# EAGLE schematic HDMIspartan6_Rev_A.brd (EAGLE 7.7.0)

## Sheet 1 of 4
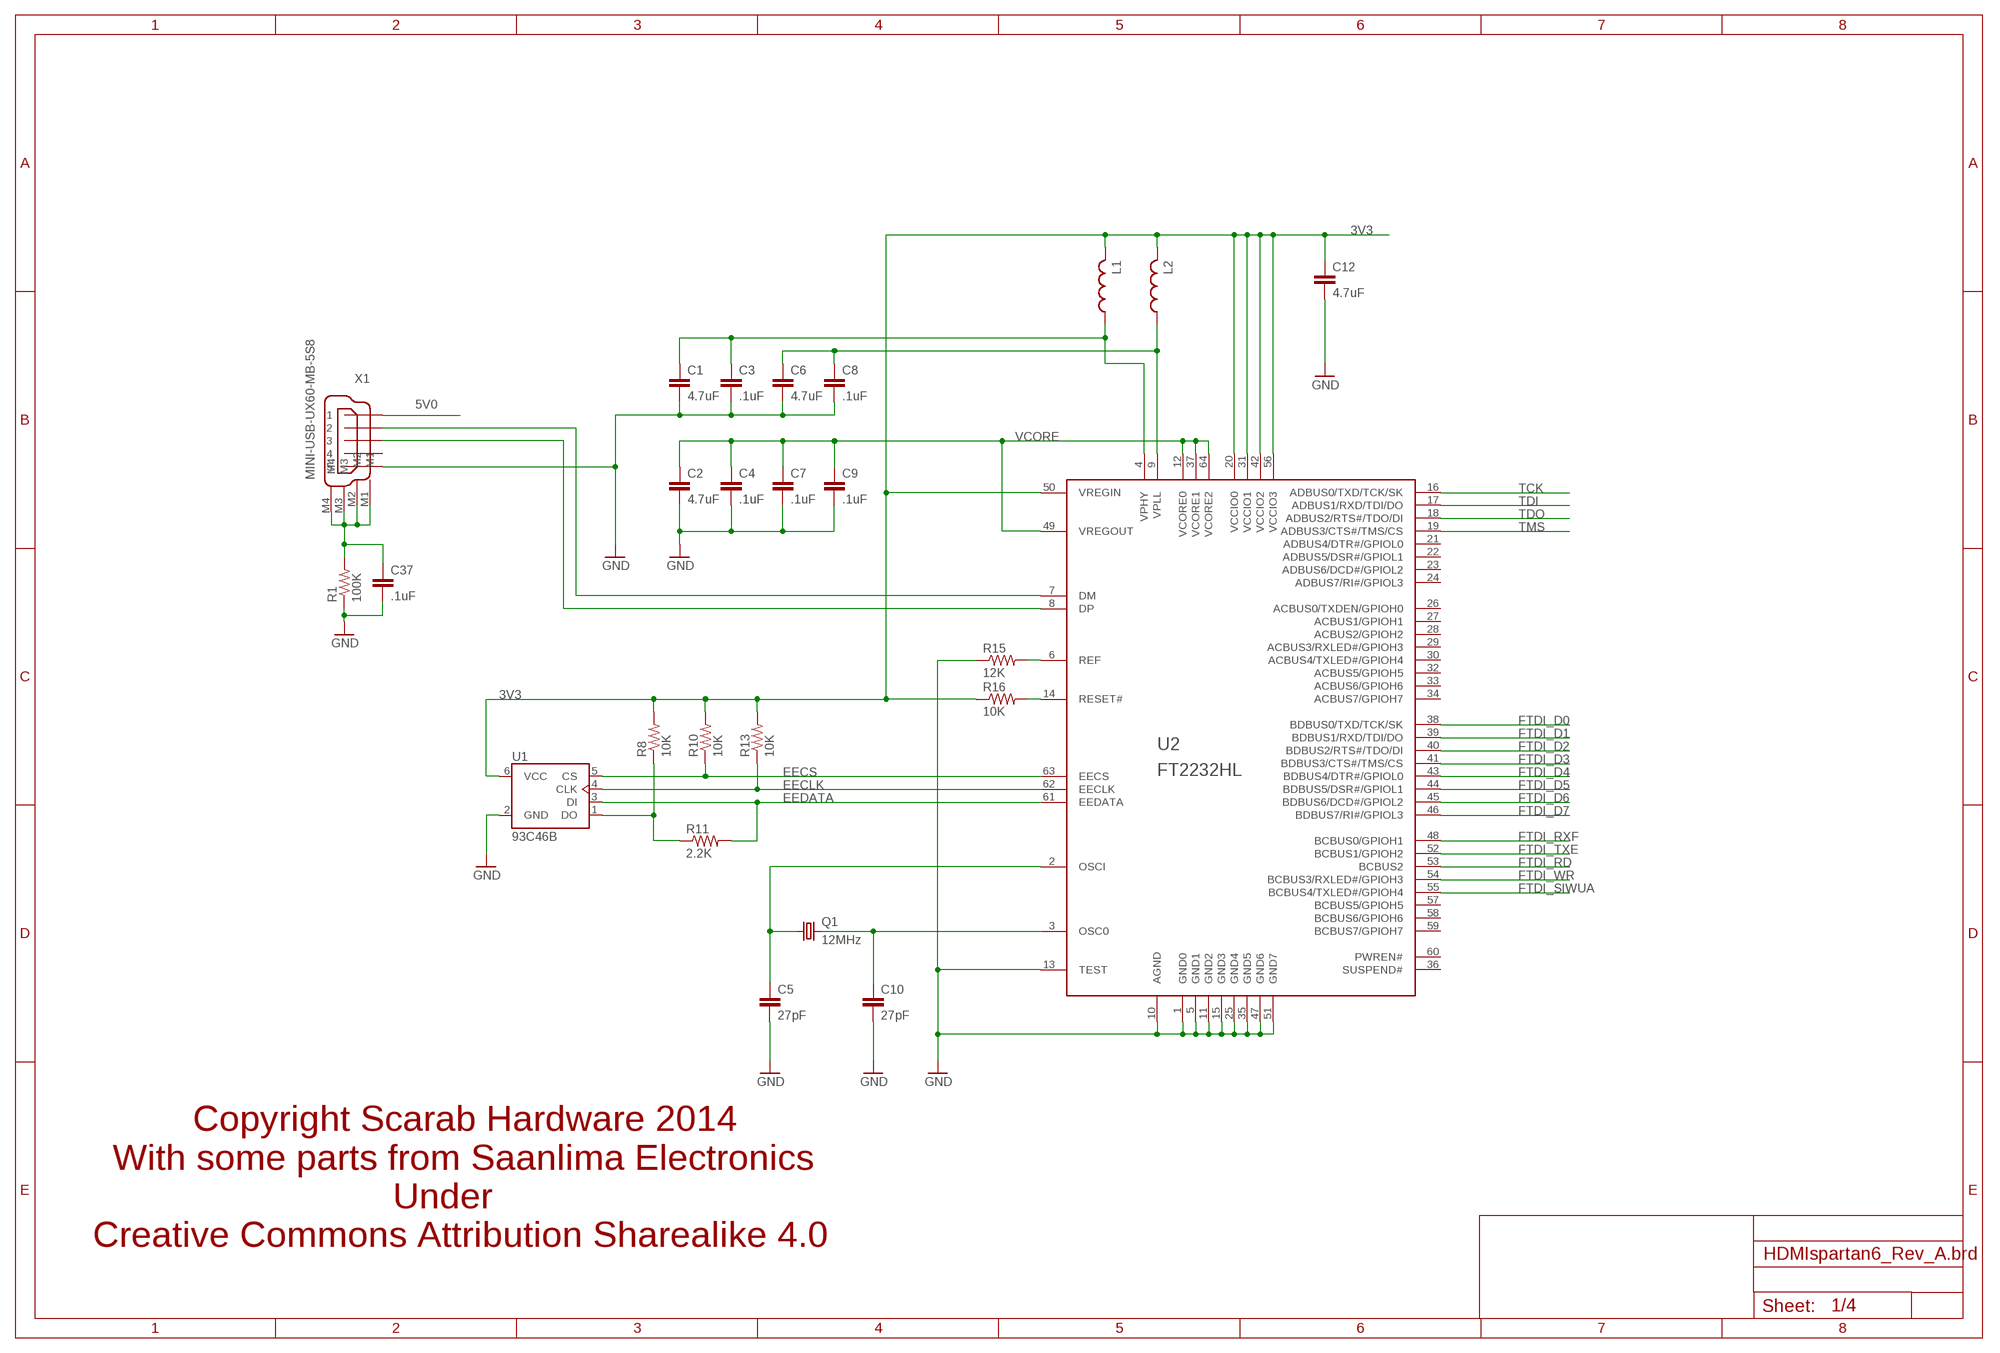
[diagram p0: schematic, sheet 1]

### Parts
C1  4.7uF  C-EUC0603K  [C0603K]
C2  4.7uF  C-EUC0603K  [C0603K]
C3  .1uF  C-EUC0603K  [C0603K]
C4  .1uF  C-EUC0603K  [C0603K]
C5  27pF  C-EUC0603K  [C0603K]
C6  4.7uF  C-EUC0603K  [C0603K]
C7  .1uF  C-EUC0603K  [C0603K]
C8  .1uF  C-EUC0603K  [C0603K]
C9  .1uF  C-EUC0603K  [C0603K]
C10  27pF  C-EUC0603K  [C0603K]
C12  4.7uF  C-EUC0603K  [C0603K]
C37  .1uF  C-EUC0603K  [C0603K]
L1  L-USL2012C  [L2012C]
L2  L-USL2012C  [L2012C]
Q1  12MHz  CRYSTAL3.2X2.5  [CRYSTAL3.2X2.5MM]
R1  100K  R-US_R0603  [R0603]
R8  10K  R-US_R0603  [R0603]
R10  10K  R-US_R0603  [R0603]
R11  2.2K  R-US_R0603  [R0603]
R13  10K  R-US_R0603  [R0603]
R15  12K  R-US_R0603  [R0603]
R16  10K  R-US_R0603  [R0603]
U1  93C46B  DIGITAL-EEPROM-MICROWIRE-6P_SOT23  [SOT23-6]
U2  FT2232HL  FT2232H  [LQFP64]
X1  MINI-USB-UX60-MB-5S8  [UX60-MB-5S8]

### Nets
3V3: C12.1 L1.2 L2.2 R8.2 R10.2 R13.2 R16.1 U1.6(VCC) U2.20(VCCIO0) U2.31(VCCIO1) U2.42(VCCIO2) U2.50(VREGIN) U2.56(VCCIO3) ; also sheet 2,3,4
5V0: X1.1 ; also sheet 3
EECLK: R13.1 U1.4(CLK) U2.62(EECLK)
EECS: R10.1 U1.5(CS) U2.63(EECS)
EEDATA: R11.2 U1.3(DI) U2.61(EEDATA)
FTDI_D0: U2.38(BDBUS0/TXD/TCK/SK) ; also sheet 2
FTDI_D1: U2.39(BDBUS1/RXD/TDI/DO) ; also sheet 2
FTDI_D2: U2.40(BDBUS2/RTS#/TDO/DI) ; also sheet 2
FTDI_D3: U2.41(BDBUS3/CTS#/TMS/CS) ; also sheet 2
FTDI_D4: U2.43(BDBUS4/DTR#/GPIOL0) ; also sheet 2
FTDI_D5: U2.44(BDBUS5/DSR#/GPIOL1) ; also sheet 2
FTDI_D6: U2.45(BDBUS6/DCD#/GPIOL2) ; also sheet 2
FTDI_D7: U2.46(BDBUS7/RI#/GPIOL3) ; also sheet 2
FTDI_RD: U2.53(BCBUS2) ; also sheet 2
FTDI_RXF: U2.48(BCBUS0/GPIOH1) ; also sheet 2
FTDI_SIWUA: U2.55(BCBUS4/TXLED#/GPIOH4) ; also sheet 2
FTDI_TXE: U2.52(BCBUS1/GPIOH2) ; also sheet 2
FTDI_WR: U2.54(BCBUS3/RXLED#/GPIOH3) ; also sheet 2
GND: C1.2 C2.2 C3.2 C4.2 C5.2 C6.2 C7.2 C8.2 C9.2 C10.2 C12.2 C37.2 R1.1 R15.1 U1.2(GND) U2.1(GND0) U2.5(GND1) U2.10(AGND) U2.11(GND2) U2.13(TEST) U2.15(GND3) U2.25(GND4) U2.35(GND5) U2.47(GND6) U2.51(GND7) X1.5 ; also sheet 2,3,4
N$10: U2.7(DM) X1.2
N$13: C37.1 R1.2 X1.M1 X1.M2 X1.M3 X1.M4
N$14: U2.8(DP) X1.3
N$15: C5.1 Q1.1 U2.2(OSCI)
N$16: C10.1 Q1.3 U2.3(OSC0)
N$18: C6.1 C8.1 L2.1 U2.9(VPLL)
N$19: R16.2 U2.14(RESET#)
N$20: R15.2 U2.6(REF)
N$21: C1.1 C3.1 L1.1 U2.4(VPHY)
N$27: R8.1 R11.1 U1.1(DO)
TCK: U2.16(ADBUS0/TXD/TCK/SK) ; also sheet 2
TDI: U2.17(ADBUS1/RXD/TDI/DO) ; also sheet 2
TDO: U2.18(ADBUS2/RTS#/TDO/DI) ; also sheet 2
TMS: U2.19(ADBUS3/CTS#/TMS/CS) ; also sheet 2
VCORE: C2.1 C4.1 C7.1 C9.1 U2.12(VCORE0) U2.37(VCORE1) U2.49(VREGOUT) U2.64(VCORE2)
Unconnected: U2.21(ADBUS4/DTR#/GPIOL0) U2.22(ADBUS5/DSR#/GPIOL1) U2.23(ADBUS6/DCD#/GPIOL2) U2.24(ADBUS7/RI#/GPIOL3) U2.26(ACBUS0/TXDEN/GPIOH0) U2.27(ACBUS1/GPIOH1) U2.28(ACBUS2/GPIOH2) U2.29(ACBUS3/RXLED#/GPIOH3) U2.30(ACBUS4/TXLED#/GPIOH4) U2.32(ACBUS5/GPIOH5) U2.33(ACBUS6/GPIOH6) U2.34(ACBUS7/GPIOH7) U2.36(SUSPEND#) U2.57(BCBUS5/GPIOH5) U2.58(BCBUS6/GPIOH6) U2.59(BCBUS7/GPIOH7) U2.60(PWREN#) X1.4

### Notes on the sheet
- Copyright Scarab Hardware 2014
    With some parts from Saanlima Electronics
                                Under
  Creative Commons Attribution Sharealike 4.0

## Sheet 2 of 4
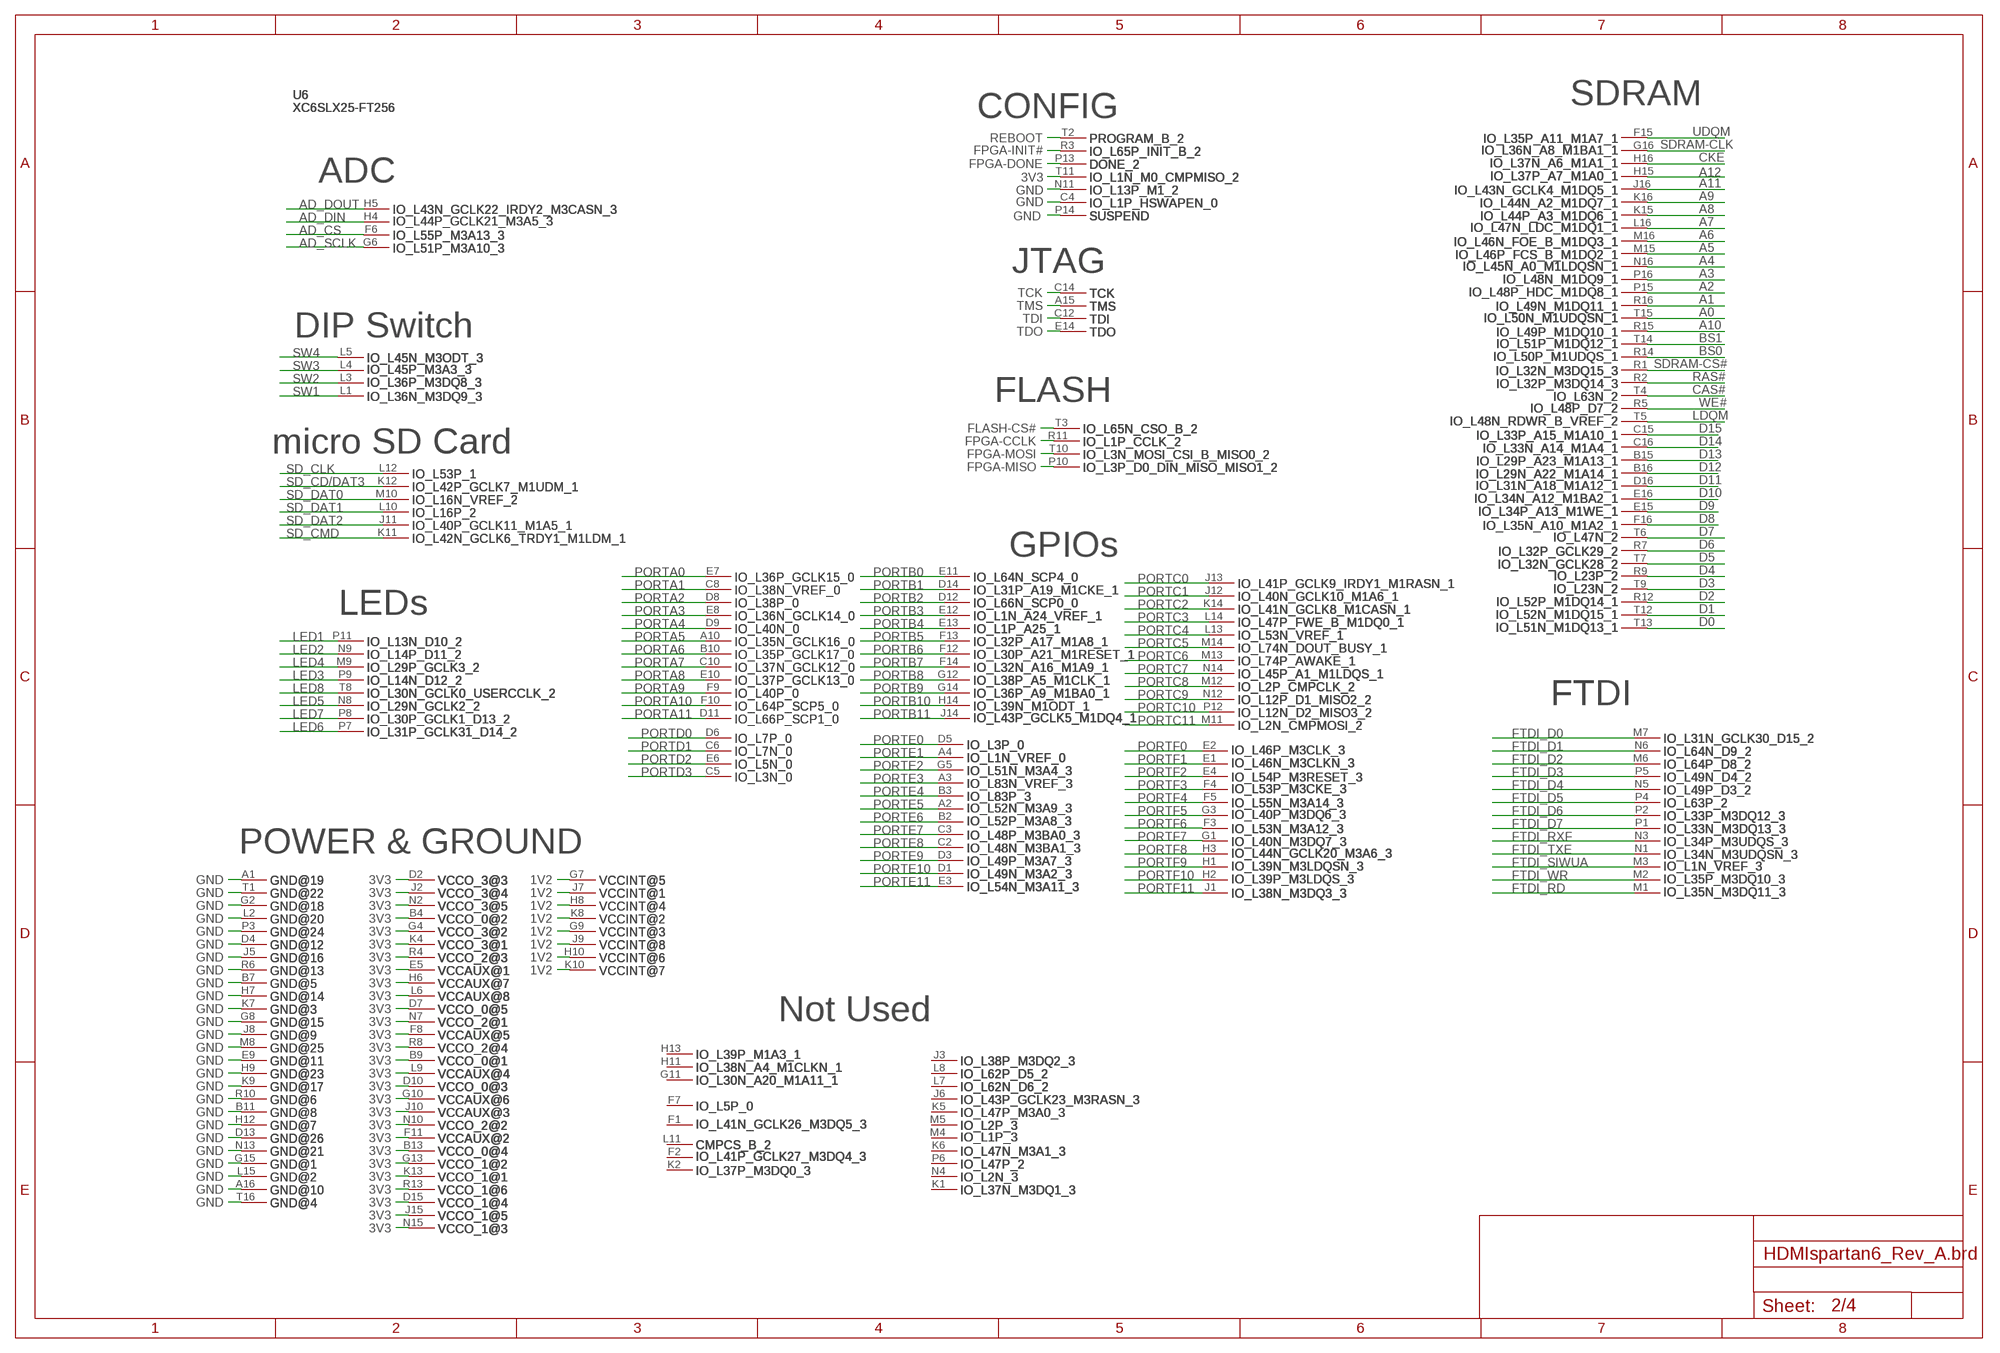
[diagram p1: schematic, sheet 2]

### Parts
U6  XC6SLX25-FT256  [XILINX-FT256]

### Nets
1V2: U6.G7 U6.G9 U6.H8 U6.H10 U6.J7 U6.J9 U6.K8 U6.K10 ; also sheet 3
3V3: U6.B4 U6.B9 U6.B13 U6.D2 U6.D7 U6.D10 U6.D15 U6.E5 U6.F8 U6.F11 U6.G4 U6.G10 U6.G13 U6.H6 U6.J2 U6.J10 U6.J15 U6.K4 U6.K13 U6.L6 U6.L9 U6.N2 U6.N7 U6.N10 U6.N15 U6.R4 U6.R8 U6.R13 U6.T11 ; also sheet 1,3,4
A0: U6.T15 ; also sheet 3
A1: U6.R16 ; also sheet 3
A2: U6.P15 ; also sheet 3
A3: U6.P16 ; also sheet 3
A4: U6.N16 ; also sheet 3
A5: U6.M15 ; also sheet 3
A6: U6.M16 ; also sheet 3
A7: U6.L16 ; also sheet 3
A8: U6.K15 ; also sheet 3
A9: U6.K16 ; also sheet 3
A10: U6.R15 ; also sheet 3
A11: U6.J16 ; also sheet 3
A12: U6.H15 ; also sheet 3
AD_CS: U6.F6 ; also sheet 3
AD_DIN: U6.H4 ; also sheet 3
AD_DOUT: U6.H5 ; also sheet 3
AD_SCLK: U6.G6 ; also sheet 3
BS0: U6.R14 ; also sheet 3
BS1: U6.T14 ; also sheet 3
CAS#: U6.T4 ; also sheet 3
CKE: U6.H16 ; also sheet 3
D0: U6.T13 ; also sheet 3
D1: U6.T12 ; also sheet 3
D2: U6.R12 ; also sheet 3
D3: U6.T9 ; also sheet 3
D4: U6.R9 ; also sheet 3
D5: U6.T7 ; also sheet 3
D6: U6.R7 ; also sheet 3
D7: U6.T6 ; also sheet 3
D8: U6.F16 ; also sheet 3
D9: U6.E15 ; also sheet 3
D10: U6.E16 ; also sheet 3
D11: U6.D16 ; also sheet 3
D12: U6.B16 ; also sheet 3
D13: U6.B15 ; also sheet 3
D14: U6.C16 ; also sheet 3
D15: U6.C15 ; also sheet 3
FLASH-CS#: U6.T3 ; also sheet 3
FPGA-CCLK: U6.R11 ; also sheet 3
FPGA-DONE: U6.P13
FPGA-INIT#: U6.R3
FPGA-MISO: U6.P10 ; also sheet 3
FPGA-MOSI: U6.T10 ; also sheet 3
FTDI_D0: U6.M7 ; also sheet 1
FTDI_D1: U6.N6 ; also sheet 1
FTDI_D2: U6.M6 ; also sheet 1
FTDI_D3: U6.P5 ; also sheet 1
FTDI_D4: U6.N5 ; also sheet 1
FTDI_D5: U6.P4 ; also sheet 1
FTDI_D6: U6.P2 ; also sheet 1
FTDI_D7: U6.P1 ; also sheet 1
FTDI_RD: U6.M1 ; also sheet 1
FTDI_RXF: U6.N3 ; also sheet 1
FTDI_SIWUA: U6.M3 ; also sheet 1
FTDI_TXE: U6.N1 ; also sheet 1
FTDI_WR: U6.M2 ; also sheet 1
GND: U6.A1 U6.A16 U6.B7 U6.B11 U6.C4 U6.D4 U6.D13 U6.E9 U6.G2 U6.G8 U6.G15 U6.H7 U6.H9 U6.H12 U6.J5 U6.J8 U6.K7 U6.K9 U6.L2 U6.L15 U6.M8 U6.N11 U6.N13 U6.P3 U6.P14 U6.R6 U6.R10 U6.T1 U6.T16 ; also sheet 1,3,4
LDQM: U6.T5 ; also sheet 3
LED1: U6.P11 ; also sheet 3
LED2: U6.N9 ; also sheet 3
LED3: U6.P9 ; also sheet 3
LED4: U6.M9 ; also sheet 3
LED5: U6.N8 ; also sheet 3
LED6: U6.P7 ; also sheet 3
LED7: U6.P8 ; also sheet 3
LED8: U6.T8 ; also sheet 3
PORTA0: U6.E7 ; also sheet 3
PORTA1: U6.C8 ; also sheet 3
PORTA2: U6.D8 ; also sheet 3
PORTA3: U6.E8 ; also sheet 3
PORTA4: U6.D9 ; also sheet 3
PORTA5: U6.A10 ; also sheet 3
PORTA6: U6.B10 ; also sheet 3
PORTA7: U6.C10 ; also sheet 3
PORTA8: U6.E10 ; also sheet 3
PORTA9: U6.F9 ; also sheet 3
PORTA10: U6.F10 ; also sheet 3
PORTA11: U6.D11 ; also sheet 3
PORTB0: U6.E11 ; also sheet 3
PORTB1: U6.D14 ; also sheet 3
PORTB2: U6.D12 ; also sheet 3
PORTB3: U6.E12 ; also sheet 3
PORTB4: U6.E13 ; also sheet 3
PORTB5: U6.F13 ; also sheet 3
PORTB6: U6.F12 ; also sheet 3
PORTB7: U6.F14 ; also sheet 3
PORTB8: U6.G12 ; also sheet 3
PORTB9: U6.G14 ; also sheet 3
PORTB10: U6.H14 ; also sheet 3
PORTB11: U6.J14 ; also sheet 3
PORTC0: U6.J13 ; also sheet 3
PORTC1: U6.J12 ; also sheet 3
PORTC2: U6.K14 ; also sheet 3
PORTC3: U6.L14 ; also sheet 3
PORTC4: U6.L13 ; also sheet 3
PORTC5: U6.M14 ; also sheet 3
PORTC6: U6.M13 ; also sheet 3
PORTC7: U6.N14 ; also sheet 3
PORTC8: U6.M12 ; also sheet 3
PORTC9: U6.N12 ; also sheet 3
PORTC10: U6.P12 ; also sheet 3
PORTC11: U6.M11 ; also sheet 3
PORTD0: U6.D6 ; also sheet 3
PORTD1: U6.C6 ; also sheet 3
PORTD2: U6.E6 ; also sheet 3
PORTD3: U6.C5 ; also sheet 3
PORTE0: U6.D5 ; also sheet 3
PORTE1: U6.A4 ; also sheet 3
PORTE2: U6.G5 ; also sheet 3
PORTE3: U6.A3 ; also sheet 3
PORTE4: U6.B3 ; also sheet 3
PORTE5: U6.A2 ; also sheet 3
PORTE6: U6.B2 ; also sheet 3
PORTE7: U6.C3 ; also sheet 3
PORTE8: U6.C2 ; also sheet 3
PORTE9: U6.D3 ; also sheet 3
PORTE10: U6.D1 ; also sheet 3
PORTE11: U6.E3 ; also sheet 3
PORTF0: U6.E2 ; also sheet 3
PORTF1: U6.E1 ; also sheet 3
PORTF2: U6.E4 ; also sheet 3
PORTF3: U6.F4 ; also sheet 3
PORTF4: U6.F5 ; also sheet 3
PORTF5: U6.G3 ; also sheet 3
PORTF6: U6.F3 ; also sheet 3
PORTF7: U6.G1 ; also sheet 3
PORTF8: U6.H3 ; also sheet 3
PORTF9: U6.H1 ; also sheet 3
PORTF10: U6.H2 ; also sheet 3
PORTF11: U6.J1 ; also sheet 3
RAS#: U6.R2 ; also sheet 3
REBOOT: U6.T2 ; also sheet 3
SD_CD/DAT3: U6.K12 ; also sheet 3
SD_CLK: U6.L12 ; also sheet 3
SD_CMD: U6.K11 ; also sheet 3
SD_DAT0: U6.M10 ; also sheet 3
SD_DAT1: U6.L10 ; also sheet 3
SD_DAT2: U6.J11 ; also sheet 3
SDRAM-CLK: U6.G16 ; also sheet 3
SDRAM-CS#: U6.R1 ; also sheet 3
SW1: U6.L1 ; also sheet 3
SW2: U6.L3 ; also sheet 3
SW3: U6.L4 ; also sheet 3
SW4: U6.L5 ; also sheet 3
TCK: U6.C14 ; also sheet 1
TDI: U6.C12 ; also sheet 1
TDO: U6.E14 ; also sheet 1
TMS: U6.A15 ; also sheet 1
UDQM: U6.F15 ; also sheet 3
WE#: U6.R5 ; also sheet 3
Unconnected: U6.F1 U6.F2 U6.F7 U6.G11 U6.H11 U6.H13 U6.J3 U6.J6 U6.K1 U6.K2 U6.K5 U6.K6 U6.L7 U6.L8 U6.L11 U6.M4 U6.M5 U6.N4 U6.P6

### Notes on the sheet
- CONFIG
- SDRAM
- ADC
- JTAG
- DIP Switch
- FLASH
- micro SD Card
- GPIOs
- LEDs
- FTDI
- POWER & GROUND
- Not Used

## Sheet 3 of 4
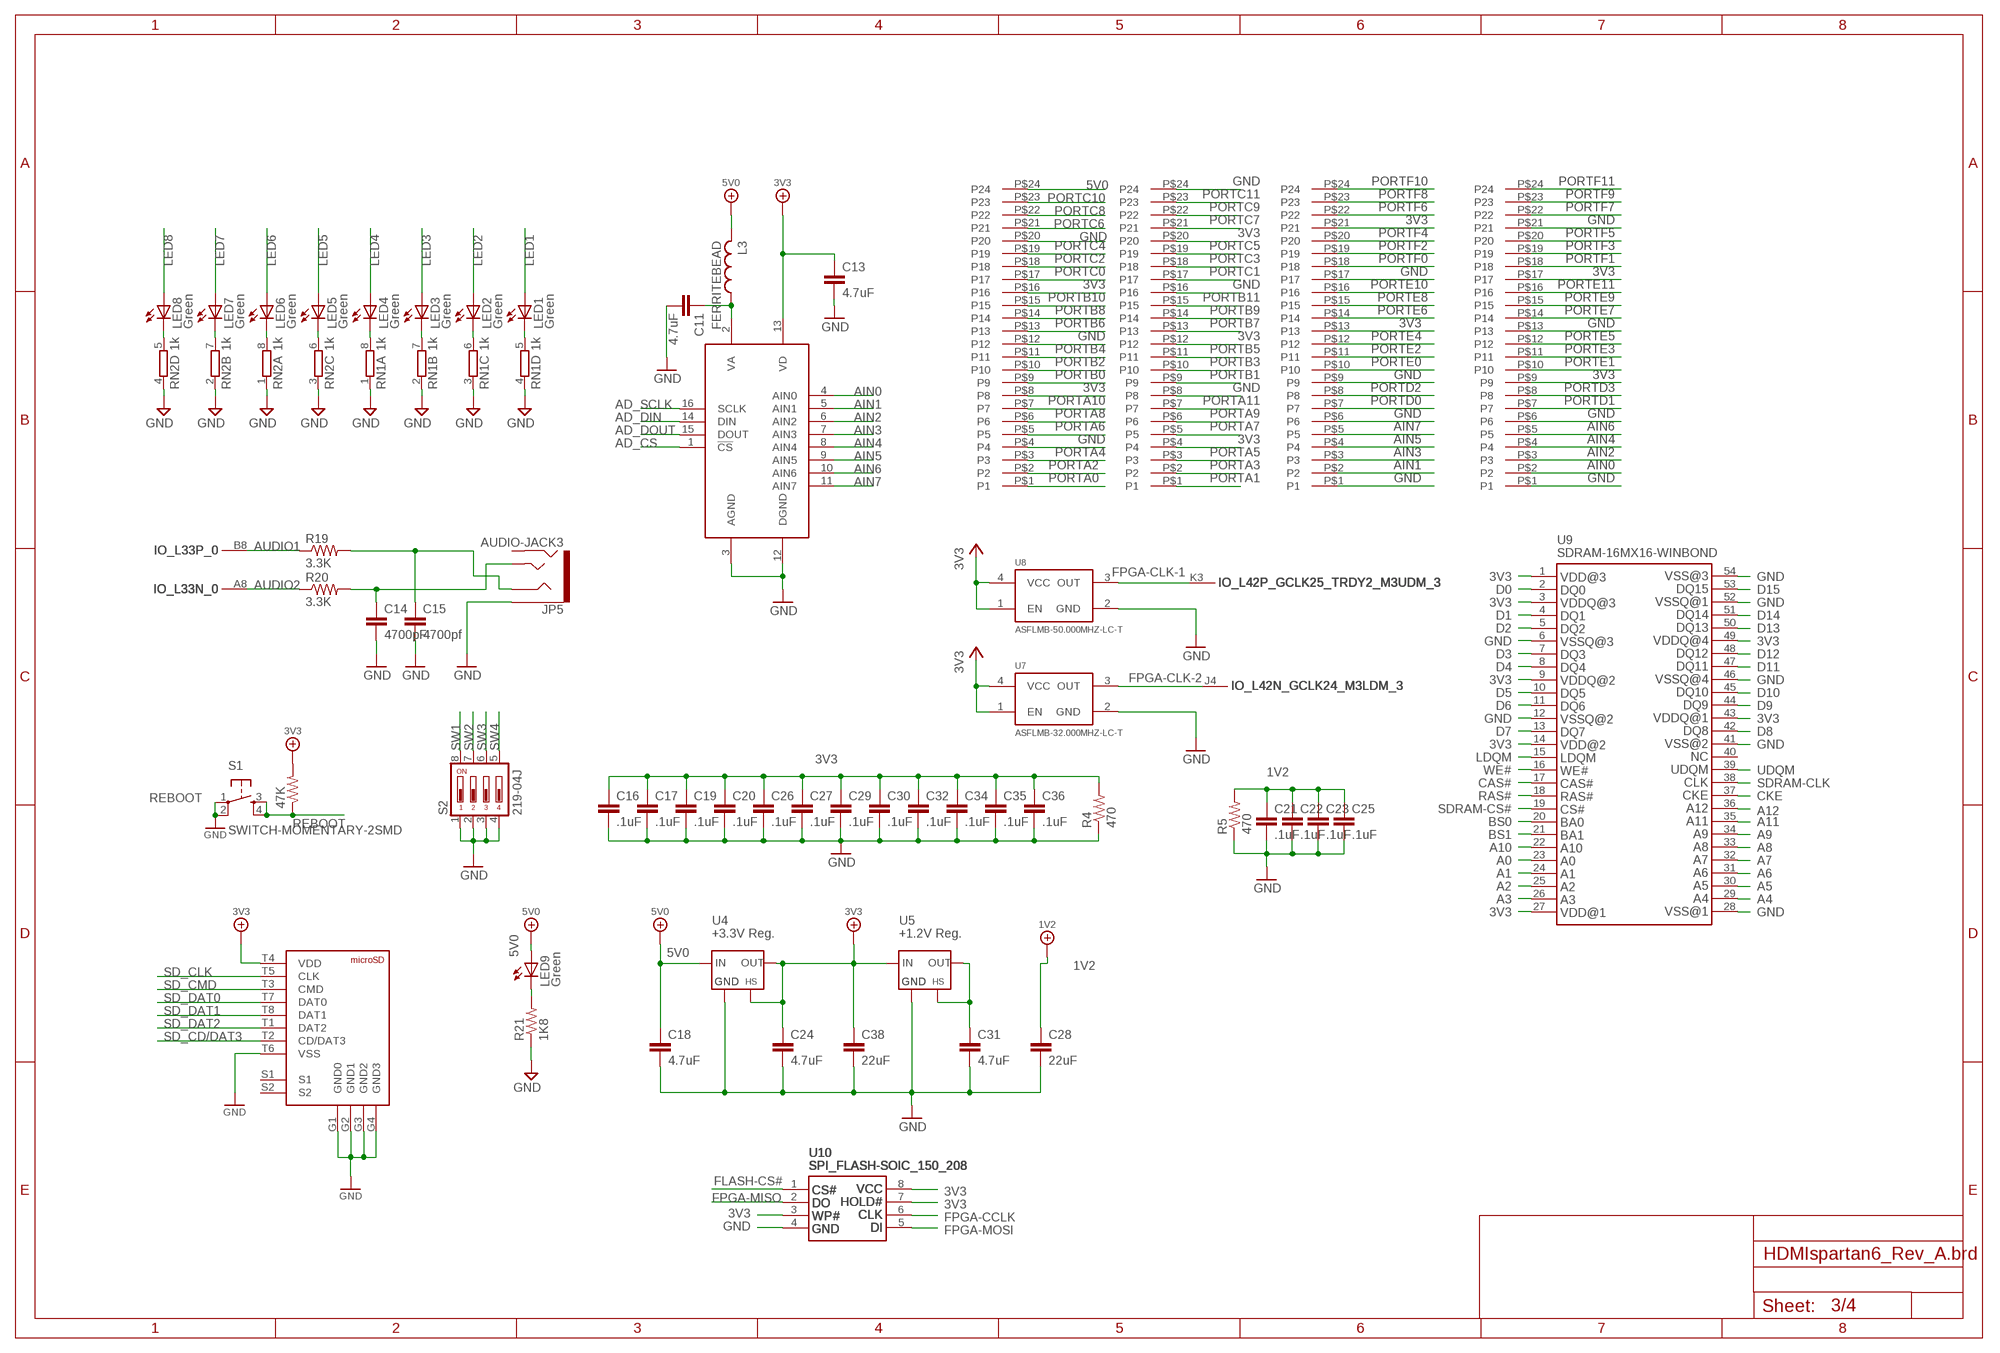
[diagram p2: schematic, sheet 3]

### Parts
C11  4.7uF  C-EUC0603K  [C0603K]
C13  4.7uF  C-EUC0603K  [C0603K]
C14  4700pF  C-EUC0603K  [C0603K]
C15  4700pf  C-EUC0603K  [C0603K]
C16  .1uF  C-EUC0603K  [C0603K]
C17  .1uF  C-EUC0603K  [C0603K]
C18  4.7uF  C-EUC0603K  [C0603K]
C19  .1uF  C-EUC0603K  [C0603K]
C20  .1uF  C-EUC0603K  [C0603K]
C21  .1uF  C-EUC0603K  [C0603K]
C22  .1uF  C-EUC0603K  [C0603K]
C23  .1uF  C-EUC0603K  [C0603K]
C24  4.7uF  C-EUC0603K  [C0603K]
C25  .1uF  C-EUC0603K  [C0603K]
C26  .1uF  C-EUC0603K  [C0603K]
C27  .1uF  C-EUC0603K  [C0603K]
C28  22uF  C-EUC0603K  [C0603K]
C29  .1uF  C-EUC0603K  [C0603K]
C30  .1uF  C-EUC0603K  [C0603K]
C31  4.7uF  C-EUC0603K  [C0603K]
C32  .1uF  C-EUC0603K  [C0603K]
C34  .1uF  C-EUC0603K  [C0603K]
C35  .1uF  C-EUC0603K  [C0603K]
C36  .1uF  C-EUC0603K  [C0603K]
C38  22uF  C-EUC0603K  [C0603K]
J4  P24-1  [1X24]
J5  MICROSD_MOLEX  [MICROSD_104031]
J6  P24-1  [1X24]
JP5  AUDIO-JACK3  [AUDIO-JACK-TRRS-SMD]
L3  FERRITEBEAD  L-USL2012C  [L2012C]
LED1  Green  LEDSML0603  [SML0603]
LED2  Green  LEDSML0603  [SML0603]
LED3  Green  LEDSML0603  [SML0603]
LED4  Green  LEDSML0603  [SML0603]
LED5  Green  LEDSML0603  [SML0603]
LED6  Green  LEDSML0603  [SML0603]
LED7  Green  LEDSML0603  [SML0603]
LED8  Green  LEDSML0603  [SML0603]
LED9  Green  LEDSML0603  [SML0603]
R4  470  R-US_R0603  [R0603]
R5  470  R-US_R0603  [R0603]
R18  47K  R-US_R0603  [R0603]
R19  3.3K  R-US_R0603  [R0603]
R20  3.3K  R-US_R0603  [R0603]
R21  1K8  R-US_R0603  [R0603]
RN1  1k  4R-N0603-ARV  [0603-ARV]
RN2  1k  4R-N0603-ARV  [0603-ARV]
S1  SWITCH-MOMENTARY-2SMD  TAC_SWITCHSMD  [TACTILE_SWITCH_SMD]
S2  219-04J  [CTS-219-04J]
U3  ADC088S102CIMT  [TSSOP16]
U4  +3.3V Reg.  FAN1117  [SOT223]
U5  +1.2V Reg.  FAN1112  [SOT223]
U7  ASFLMB-32.000MHZ-LC-T  OSCILLATOR5X3-PIN1-INDICATED  [CRYSTAL-OSC-SMD-5X3]
U8  ASFLMB-50.000MHZ-LC-T  OSCILLATOR5X3-PIN1-INDICATED  [CRYSTAL-OSC-SMD-5X3]
U9  SDRAM-16MX16-WINBOND  [TSOPII-54]
U10  SPI_FLASH-SOIC_150_208  [SPI-8_SOIC_150_208]
U$7  P24-1  [1X24]
U$8  P24-1  [1X24]

### Nets
1V2: C21.1 C22.1 C23.1 C25.1 C28.1 R5.2 ; also sheet 2
3V3: C13.1 C16.1 C17.1 C19.1 C20.1 C24.1 C26.1 C27.1 C29.1 C30.1 C32.1 C34.1 C35.1 C36.1 C38.1 J4.P$13(P13) J4.P$21(P21) J5.T4(VDD) J6.P$9(P9) J6.P$17(P17) R4.2 R18.2 U3.13(VD) U4.2(OUT) U4.4(HS) U5.3(IN) U7.1(EN) U7.4(VCC) U8.1(EN) U8.4(VCC) U9.1 U9.3 U9.9 U9.14 U9.27 U9.43 U9.49 U10.3 U10.7 U10.8 U$7.P$8(P8) U$7.P$16(P16) U$8.P$4(P4) U$8.P$12(P12) U$8.P$20(P20) ; also sheet 1,2,4
5V0: C18.1 L3.2 LED9.A U4.3(IN) U$7.P$24(P24) ; also sheet 1
A0: U9.23 ; also sheet 2
A1: U9.24 ; also sheet 2
A2: U9.25 ; also sheet 2
A3: U9.26 ; also sheet 2
A4: U9.29 ; also sheet 2
A5: U9.30 ; also sheet 2
A6: U9.31 ; also sheet 2
A7: U9.32 ; also sheet 2
A8: U9.33 ; also sheet 2
A9: U9.34 ; also sheet 2
A10: U9.22 ; also sheet 2
A11: U9.35 ; also sheet 2
A12: U9.36 ; also sheet 2
AD_CS: U3.1(!CS) ; also sheet 2
AD_DIN: U3.14(DIN) ; also sheet 2
AD_DOUT: U3.15(DOUT) ; also sheet 2
AD_SCLK: U3.16(SCLK) ; also sheet 2
AIN0: J6.P$2(P2) U3.4(AIN0)
AIN1: J4.P$2(P2) U3.5(AIN1)
AIN2: J6.P$3(P3) U3.6(AIN2)
AIN3: J4.P$3(P3) U3.7(AIN3)
AIN4: J6.P$4(P4) U3.8(AIN4)
AIN5: J4.P$4(P4) U3.9(AIN5)
AIN6: J6.P$5(P5) U3.10(AIN6)
AIN7: J4.P$5(P5) U3.11(AIN7)
AUDIO1: R19.1 U6.B8
AUDIO2: R20.1 U6.A8
BS0: U9.20 ; also sheet 2
BS1: U9.21 ; also sheet 2
CAS#: U9.17 ; also sheet 2
CKE: U9.37 ; also sheet 2
D0: U9.2 ; also sheet 2
D1: U9.4 ; also sheet 2
D2: U9.5 ; also sheet 2
D3: U9.7 ; also sheet 2
D4: U9.8 ; also sheet 2
D5: U9.10 ; also sheet 2
D6: U9.11 ; also sheet 2
D7: U9.13 ; also sheet 2
D8: U9.42 ; also sheet 2
D9: U9.44 ; also sheet 2
D10: U9.45 ; also sheet 2
D11: U9.47 ; also sheet 2
D12: U9.48 ; also sheet 2
D13: U9.50 ; also sheet 2
D14: U9.51 ; also sheet 2
D15: U9.53 ; also sheet 2
FLASH-CS#: U10.1 ; also sheet 2
FPGA-CCLK: U10.6 ; also sheet 2
FPGA-CLK-1: U6.K3 U8.3(OUT)
FPGA-CLK-2: U6.J4 U7.3(OUT)
FPGA-MISO: U10.2 ; also sheet 2
FPGA-MOSI: U10.5 ; also sheet 2
GND: C11.2 C13.2 C14.2 C15.2 C16.2 C17.2 C18.2 C19.2 C20.2 C21.2 C22.2 C23.2 C24.2 C25.2 C26.2 C27.2 C28.2 C29.2 C30.2 C31.2 C32.2 C34.2 C35.2 C36.2 C38.2 J4.P$1(P1) J4.P$6(P6) J4.P$9(P9) J4.P$17(P17) J5.G1(GND0) J5.G2(GND1) J5.G3(GND2) J5.G4(GND3) J5.T6(VSS) J6.P$1(P1) J6.P$6(P6) J6.P$13(P13) J6.P$21(P21) JP5.EARTH R4.1 R5.1 R21.1 RN1.1 RN1.2 RN1.3 RN1.4 RN2.1 RN2.2 RN2.3 RN2.4 S1.1 S1.2 S2.1 S2.2 S2.3 S2.4 U3.3(AGND) U3.12(DGND) U4.1(GND) U5.1(GND) U7.2(GND) U8.2(GND) U9.6 U9.12 U9.28 U9.41 U9.46 U9.52 U9.54 U10.4 U$7.P$4(P4) U$7.P$12(P12) U$7.P$20(P20) U$8.P$8(P8) U$8.P$16(P16) U$8.P$24(P24) ; also sheet 1,2,4
LDQM: U9.15 ; also sheet 2
LED1: LED1.A ; also sheet 2
LED2: LED2.A ; also sheet 2
LED3: LED3.A ; also sheet 2
LED4: LED4.A ; also sheet 2
LED5: LED5.A ; also sheet 2
LED6: LED6.A ; also sheet 2
LED7: LED7.A ; also sheet 2
LED8: LED8.A ; also sheet 2
N$1: LED9.C R21.2
N$2: C11.1 L3.1 U3.2(VA)
N$3: LED1.C RN1.5
N$4: LED2.C RN1.6
N$5: LED3.C RN1.7
N$6: LED4.C RN1.8
N$7: LED5.C RN2.6
N$9: LED6.C RN2.8
N$11: LED7.C RN2.7
N$12: LED8.C RN2.5
N$17: C31.1 U5.2(OUT) U5.4(HS)
N$24: C14.1 JP5.TIP R20.2
N$25: C15.1 JP5.RING1 R19.2
PORTA0: U$7.P$1(P1) ; also sheet 2
PORTA1: U$8.P$1(P1) ; also sheet 2
PORTA2: U$7.P$2(P2) ; also sheet 2
PORTA3: U$8.P$2(P2) ; also sheet 2
PORTA4: U$7.P$3(P3) ; also sheet 2
PORTA5: U$8.P$3(P3) ; also sheet 2
PORTA6: U$7.P$5(P5) ; also sheet 2
PORTA7: U$8.P$5(P5) ; also sheet 2
PORTA8: U$7.P$6(P6) ; also sheet 2
PORTA9: U$8.P$6(P6) ; also sheet 2
PORTA10: U$7.P$7(P7) ; also sheet 2
PORTA11: U$8.P$7(P7) ; also sheet 2
PORTB0: U$7.P$9(P9) ; also sheet 2
PORTB1: U$8.P$9(P9) ; also sheet 2
PORTB2: U$7.P$10(P10) ; also sheet 2
PORTB3: U$8.P$10(P10) ; also sheet 2
PORTB4: U$7.P$11(P11) ; also sheet 2
PORTB5: U$8.P$11(P11) ; also sheet 2
PORTB6: U$7.P$13(P13) ; also sheet 2
PORTB7: U$8.P$13(P13) ; also sheet 2
PORTB8: U$7.P$14(P14) ; also sheet 2
PORTB9: U$8.P$14(P14) ; also sheet 2
PORTB10: U$7.P$15(P15) ; also sheet 2
PORTB11: U$8.P$15(P15) ; also sheet 2
PORTC0: U$7.P$17(P17) ; also sheet 2
PORTC1: U$8.P$17(P17) ; also sheet 2
PORTC2: U$7.P$18(P18) ; also sheet 2
PORTC3: U$8.P$18(P18) ; also sheet 2
PORTC4: U$7.P$19(P19) ; also sheet 2
PORTC5: U$8.P$19(P19) ; also sheet 2
PORTC6: U$7.P$21(P21) ; also sheet 2
PORTC7: U$8.P$21(P21) ; also sheet 2
PORTC8: U$7.P$22(P22) ; also sheet 2
PORTC9: U$8.P$22(P22) ; also sheet 2
PORTC10: U$7.P$23(P23) ; also sheet 2
PORTC11: U$8.P$23(P23) ; also sheet 2
PORTD0: J4.P$7(P7) ; also sheet 2
PORTD1: J6.P$7(P7) ; also sheet 2
PORTD2: J4.P$8(P8) ; also sheet 2
PORTD3: J6.P$8(P8) ; also sheet 2
PORTE0: J4.P$10(P10) ; also sheet 2
PORTE1: J6.P$10(P10) ; also sheet 2
PORTE2: J4.P$11(P11) ; also sheet 2
PORTE3: J6.P$11(P11) ; also sheet 2
PORTE4: J4.P$12(P12) ; also sheet 2
PORTE5: J6.P$12(P12) ; also sheet 2
PORTE6: J4.P$14(P14) ; also sheet 2
PORTE7: J6.P$14(P14) ; also sheet 2
PORTE8: J4.P$15(P15) ; also sheet 2
PORTE9: J6.P$15(P15) ; also sheet 2
PORTE10: J4.P$16(P16) ; also sheet 2
PORTE11: J6.P$16(P16) ; also sheet 2
PORTF0: J4.P$18(P18) ; also sheet 2
PORTF1: J6.P$18(P18) ; also sheet 2
PORTF2: J4.P$19(P19) ; also sheet 2
PORTF3: J6.P$19(P19) ; also sheet 2
PORTF4: J4.P$20(P20) ; also sheet 2
PORTF5: J6.P$20(P20) ; also sheet 2
PORTF6: J4.P$22(P22) ; also sheet 2
PORTF7: J6.P$22(P22) ; also sheet 2
PORTF8: J4.P$23(P23) ; also sheet 2
PORTF9: J6.P$23(P23) ; also sheet 2
PORTF10: J4.P$24(P24) ; also sheet 2
PORTF11: J6.P$24(P24) ; also sheet 2
RAS#: U9.18 ; also sheet 2
REBOOT: R18.1 S1.3 S1.4 ; also sheet 2
SD_CD/DAT3: J5.T2(CD/DAT3) ; also sheet 2
SD_CLK: J5.T5(CLK) ; also sheet 2
SD_CMD: J5.T3(CMD) ; also sheet 2
SD_DAT0: J5.T7(DAT0) ; also sheet 2
SD_DAT1: J5.T8(DAT1) ; also sheet 2
SD_DAT2: J5.T1(DAT2) ; also sheet 2
SDRAM-CLK: U9.38 ; also sheet 2
SDRAM-CS#: U9.19 ; also sheet 2
SW1: S2.8 ; also sheet 2
SW2: S2.7 ; also sheet 2
SW3: S2.6 ; also sheet 2
SW4: S2.5 ; also sheet 2
UDQM: U9.39 ; also sheet 2
WE#: U9.16 ; also sheet 2
Unconnected: J5.S1 J5.S2 JP5.RING2 U9.40

### Notes on the sheet
- REBOOT

## Sheet 4 of 4
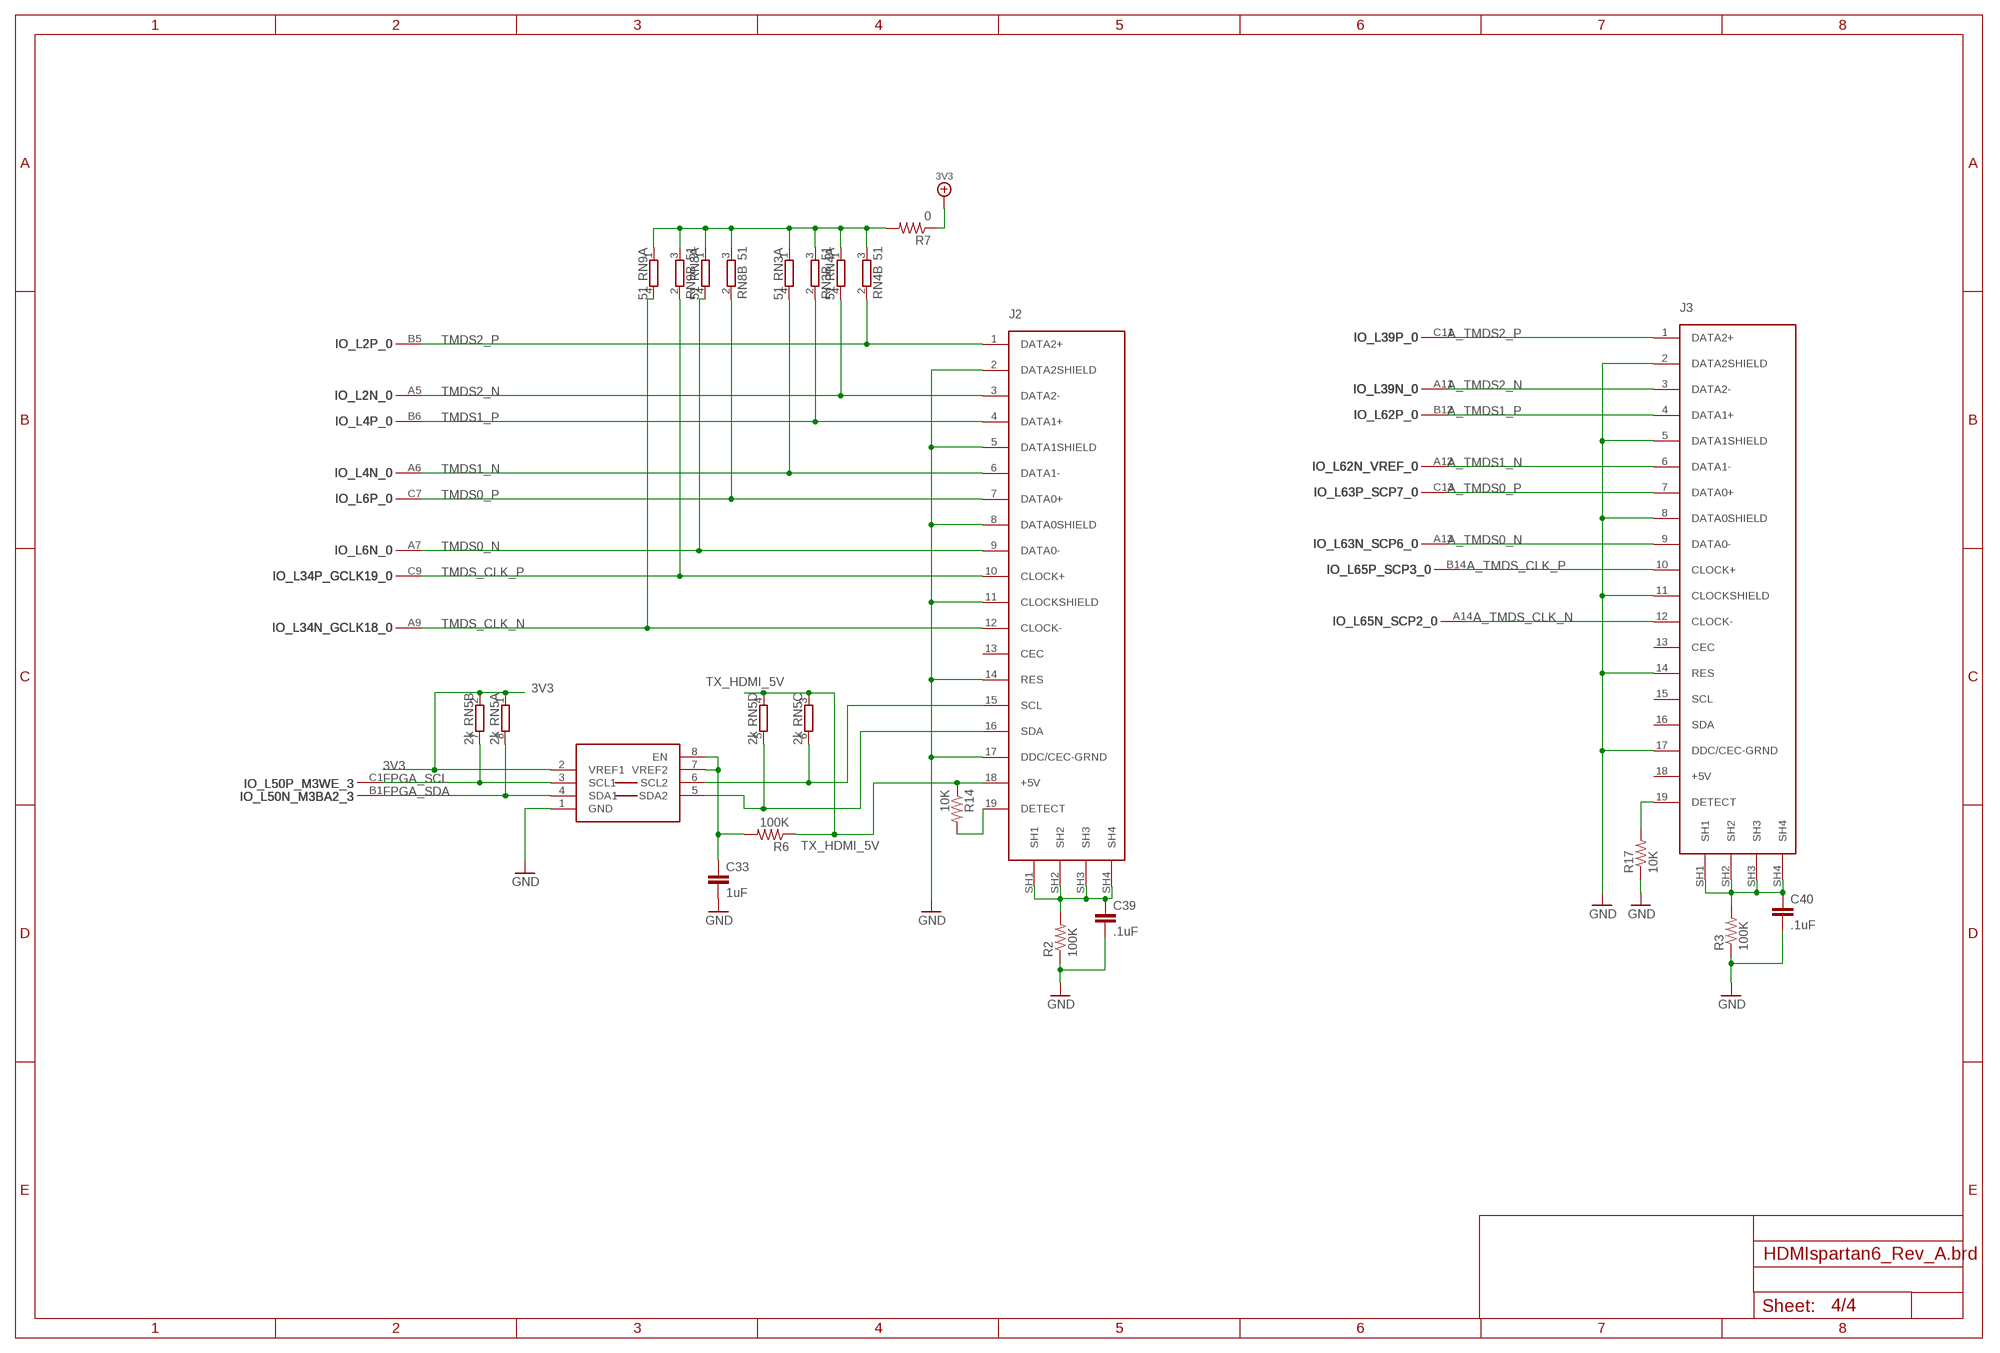
[diagram p3: schematic, sheet 4]

### Parts
C33  1uF  C-EUC0603K  [C0603K]
C39  .1uF  C-EUC0603K  [C0603K]
C40  .1uF  C-EUC0603K  [C0603K]
J2  HDMI-TYPE-A-RECEPTICALFCI10029449  [FCI-HDMI-TYPE-A-RECEPT]
J3  HDMI-TYPE-A-RECEPTICALFCI10029449  [FCI-HDMI-TYPE-A-RECEPT]
R2  100K  R-US_R0603  [R0603]
R3  100K  R-US_R0603  [R0603]
R6  100K  R-US_R0603  [R0603]
R7  0  R-US_R0603  [R0603]
R14  10K  R-US_R0603  [R0603]
R17  10K  R-US_R0603  [R0603]
RN3  51  2R-NEXB34V  [EXB34V]
RN4  51  2R-NEXB34V  [EXB34V]
RN5  2k  4R-N0603-ARV  [0603-ARV]
RN8  51  2R-NEXB34V  [EXB34V]
RN9  51  2R-NEXB34V  [EXB34V]
U11  PCA9306  [PSOP-8]

### Nets
3V3: R7.1 RN5.1 RN5.2 U11.2(VREF1) ; also sheet 1,2,3
A_TMDS0_N: J3.9(DATA0-) U6.A13
A_TMDS0_P: J3.7(DATA0+) U6.C13
A_TMDS1_N: J3.6(DATA1-) U6.A12
A_TMDS1_P: J3.4(DATA1+) U6.B12
A_TMDS2_N: J3.3(DATA2-) U6.A11
A_TMDS2_P: J3.1(DATA2+) U6.C11
A_TMDS_CLK_N: J3.12(CLOCK-) U6.A14
A_TMDS_CLK_P: J3.10(CLOCK+) U6.B14
DDC_SCL: J2.15(SCL) RN5.6 U11.6(SCL2)
DDC_SDA: J2.16(SDA) RN5.5 U11.5(SDA2)
DETECT1: J3.19(DETECT) R17.2
DETECT2: J2.19(DETECT) R14.2
FPGA_SCL: RN5.7 U6.C1 U11.3(SCL1)
FPGA_SDA: RN5.8 U6.B1 U11.4(SDA1)
GND: C33.2 C39.2 C40.2 J2.2(DATA2SHIELD) J2.5(DATA1SHIELD) J2.8(DATA0SHIELD) J2.11(CLOCKSHIELD) J2.14(RES) J2.17(DDC/CEC-GRND) J3.2(DATA2SHIELD) J3.5(DATA1SHIELD) J3.8(DATA0SHIELD) J3.11(CLOCKSHIELD) J3.14(RES) J3.17(DDC/CEC-GRND) R2.1 R3.1 R17.1 U11.1(GND) ; also sheet 1,2,3
N$8: R7.2 RN3.1 RN3.3 RN4.1 RN4.3 RN8.1 RN8.3 RN9.1 RN9.3
N$33: C33.1 R6.2 U11.7(VREF2) U11.8(EN)
N$34: C39.1 J2.SH1 J2.SH2 J2.SH3 J2.SH4 R2.2
N$36: C40.1 J3.SH1 J3.SH2 J3.SH3 J3.SH4 R3.2
TMDS0_N: J2.9(DATA0-) RN8.4 U6.A7
TMDS0_P: J2.7(DATA0+) RN8.2 U6.C7
TMDS1_N: J2.6(DATA1-) RN3.4 U6.A6
TMDS1_P: J2.4(DATA1+) RN3.2 U6.B6
TMDS2_N: J2.3(DATA2-) RN4.4 U6.A5
TMDS2_P: J2.1(DATA2+) RN4.2 U6.B5
TMDS_CLK_N: J2.12(CLOCK-) RN9.4 U6.A9
TMDS_CLK_P: J2.10(CLOCK+) RN9.2 U6.C9
TX_HDMI_5V: J2.18(+5V) R6.1 R14.1 RN5.3 RN5.4
Unconnected: J2.13(CEC) J3.13(CEC) J3.15(SCL) J3.16(SDA) J3.18(+5V)

## Library data of the parts
C1-C17 C19-C23 C25-C27 C29 C30 C32-C37 C39 C40 = rcl:C-EU: CAPACITOR, European symbol
C18 C24 C28 C31 C38 = rcl:C-EU: CAPACITOR, European symbol; DIGIKEY#: 490-3302-1-ND; MANF: Murata; MANF#: GRM188F51A475ZE20J; MOUSER#: 81-GRM188F51A475ZE20
J2 J3 = saanlima:HDMI-TYPE-A-RECEPTICAL
J4 J6 U$7 U$8 = connector:P24-1
J5 = NJC:MICROSD_MOLEX: Mouser Part #: 538-104031-0811 Manufacturer Part #: 104031-0811 Manufacturer: Molex Description: Memory Card Connectors MICRO SD PUSH-PULL SMT 1.42MM HEIGHT
JP5 = SparkFun-Connectors:AUDIO-JACK3: Audio jack - 3.5mm TRRS variety - two rings.
L1-L3 = rcl:L-US: INDUCTOR, American symbol
LED1-LED9 = led:LED: LED OSRAM: - CHIPLED LG R971, LG N971, LY N971, LG Q971, LY Q971, LO R971, LY R971 LH N974, LH R974 LS Q976, LO Q976, LY Q976 LO Q996 - Hyper CHIPLED LW Q18S LB Q993, LB Q99A, LB R99A - SideLED LS A670, LO A670, LY A670, LG A670, LP A670 LB A673, LV A673, LT A673, LW A673 LH A674 LY A675 LS A676, LA A676, LO A676, LY A676, LW A676 LS A679, LY A679, LG A679 - Hyper Micro SIDELED® LS Y876, LA Y876, LO Y876, LY Y876 LT Y87S - SmartLED LW L88C, LW L88S LB L89C, LB L89S, LG L890 LS L89K, LO L89K, LY L89K LS L896, LA L896, LO L896, LY L896 - TOPLED LS T670, LO T670, LY T670, LG T670, LP T670 LSG T670, LSP T670, LSY T670, LOP T670, LYG T670 LG T671, LOG T671, LSG T671 LB T673, LV T673, LT T673, LW T673 LH T674 LS T676, LA T676, LO T676, LY T676, LB T676, LH T676, LSB T676, LW T676 LB T67C, LV T67C, LT T67C, LS T67K, LO T67K, LY T67K, LW E67C LS E67B, LA E67B, LO E67B, LY E67B, LB E67C, LV E67C, LT E67C LW T67C LS T679, LY T679, LG T679 LS T770, LO T770, LY T770, LG T770, LP T770 LB T773, LV T773, LT T773, LW T773 LH T774 LS E675, LA E675, LY E675, LS T675 LS T776, LA T776, LO T776, LY T776, LB T776 LHGB T686 LT T68C, LB T68C - Hyper Mini TOPLED® LB M676 - Mini TOPLED Santana® LG M470 LS M47K, LO M47K, LY M47K Source: http://www.osram.convergy.de LUXEON: - LUMILED® LXK2-PW12-R00, LXK2-PW12-S00, LXK2-PW14-U00, LXK2-PW14-V00 LXK2-PM12-R00, LXK2-PM12-S00, LXK2-PM14-U00 LXK2-PE12-Q00, LXK2-PE12-R00, LXK2-PE12-S00, LXK2-PE14-T00, LXK2-PE14-U00 LXK2-PB12-K00, LXK2-PB12-L00, LXK2-PB12-M00, LXK2-PB14-N00, LXK2-PB14-P00, LXK2-PB14-Q00 LXK2-PR12-L00, LXK2-PR12-M00, LXK2-PR14-Q00, LXK2-PR14-R00 LXK2-PD12-Q00, LXK2-PD12-R00, LXK2-PD12-S00 LXK2-PH12-R00, LXK2-PH12-S00 LXK2-PL12-P00, LXK2-PL12-Q00, LXK2-PL12-R00 Source: www.luxeon.com KINGBRIGHT: KA-3528ASYC Source: www.kingbright.com
Q1 = saanlima:CRYSTAL: Crystals Various standard crystals.
R1-R8 R10 R11 R13-R21 = rcl:R-US_: RESISTOR, American symbol
RN1 RN2 RN5 = resistor-dil:4R-N: Array Chip Resistor Source: RS Component / Phycomp; OC_FARNELL: unknown; OC_NEWARK: unknown
RN3 RN4 RN8 RN9 = resistor-dil:2R-N: Array Chip Resistor Source: Panasonic; OC_FARNELL: unknown; OC_NEWARK: unknown
S1 = embeddedmicro:TAC_SWITCH: Momentary Switch Button commonly used for reset or general input. Spark Fun Electronics SKU : COM-00097
S2 = switch-dil:219-04*: Surface Mount DIP Switch Series 219 SMT CTS Electronic Components Sourc: www.ctscorp.com; OC_FARNELL: unknown; OC_NEWARK: unknown
U1 = saanlima:DIGITAL-EEPROM-MICROWIRE-6P
U2 = saanlima:FT2232H: DUAL HIGH SPEED USB TO MULTIPURPOSE UART/FIFO IC
U3 = spiadc:ADC088S102
U4 = xess:FAN1117: +3.3V Linear Regulator; DIGIKEY#: ZLDO1117G33DICT-ND; MANF: Diodes/Zetex; MANF#: ZLDO1117G33TA; MOUSER#: 522-ZLDO1117G33TA
U5 = xess:FAN1112: +1.2V Linear Regulator; DIGIKEY#: ZLDO1117G12DICT-ND; MANF: Diodes/Zetex; MANF#: ZLDO1117G12TA; MOUSER#: 522-ZLDO1117G12TA
U6 = xess:XC6SLX25-FT256: Xilinx Spartan 6 25-KLUT FPGA in FT256 package; DIGIKEY#: 122-1753-ND; MANF: XILINX; MANF#: XC6SLX25-2FTG256C
U7 U8 = embeddedmicro:OSCILLATOR: Generic 5x3 and 7x5 oscillators
U9 = xess:SDRAM-16MX16; MANF: Winbond; MANF#: W9825G6JH-5
U10 = xess:SPI_FLASH: SPI Flash; DIGIKEY#: W25Q80BVSNIG-ND; MANF: Winbond; MANF#: W25Q80BVSNIG
U11 = saanlima:PCA9306
X1 = con-hirose:MINI-USB-: MINI USB Connector Source: http://www.hirose.co.jp/cataloge_hp/e24000019.pdf; OC_FARNELL: unknown; OC_NEWARK: unknown

## Net classes
1 power: width 0.203 mm